# Altium schematic sheet BC28安全模组.SchDoc: 民用NB-IoT物联网通用膜式燃气表主控板原理图1
size A3; Date: 2022/4/25; DocumentNumber: WX0.008.316; Revision: V1; SheetNumber: 1; SheetTotal: 2
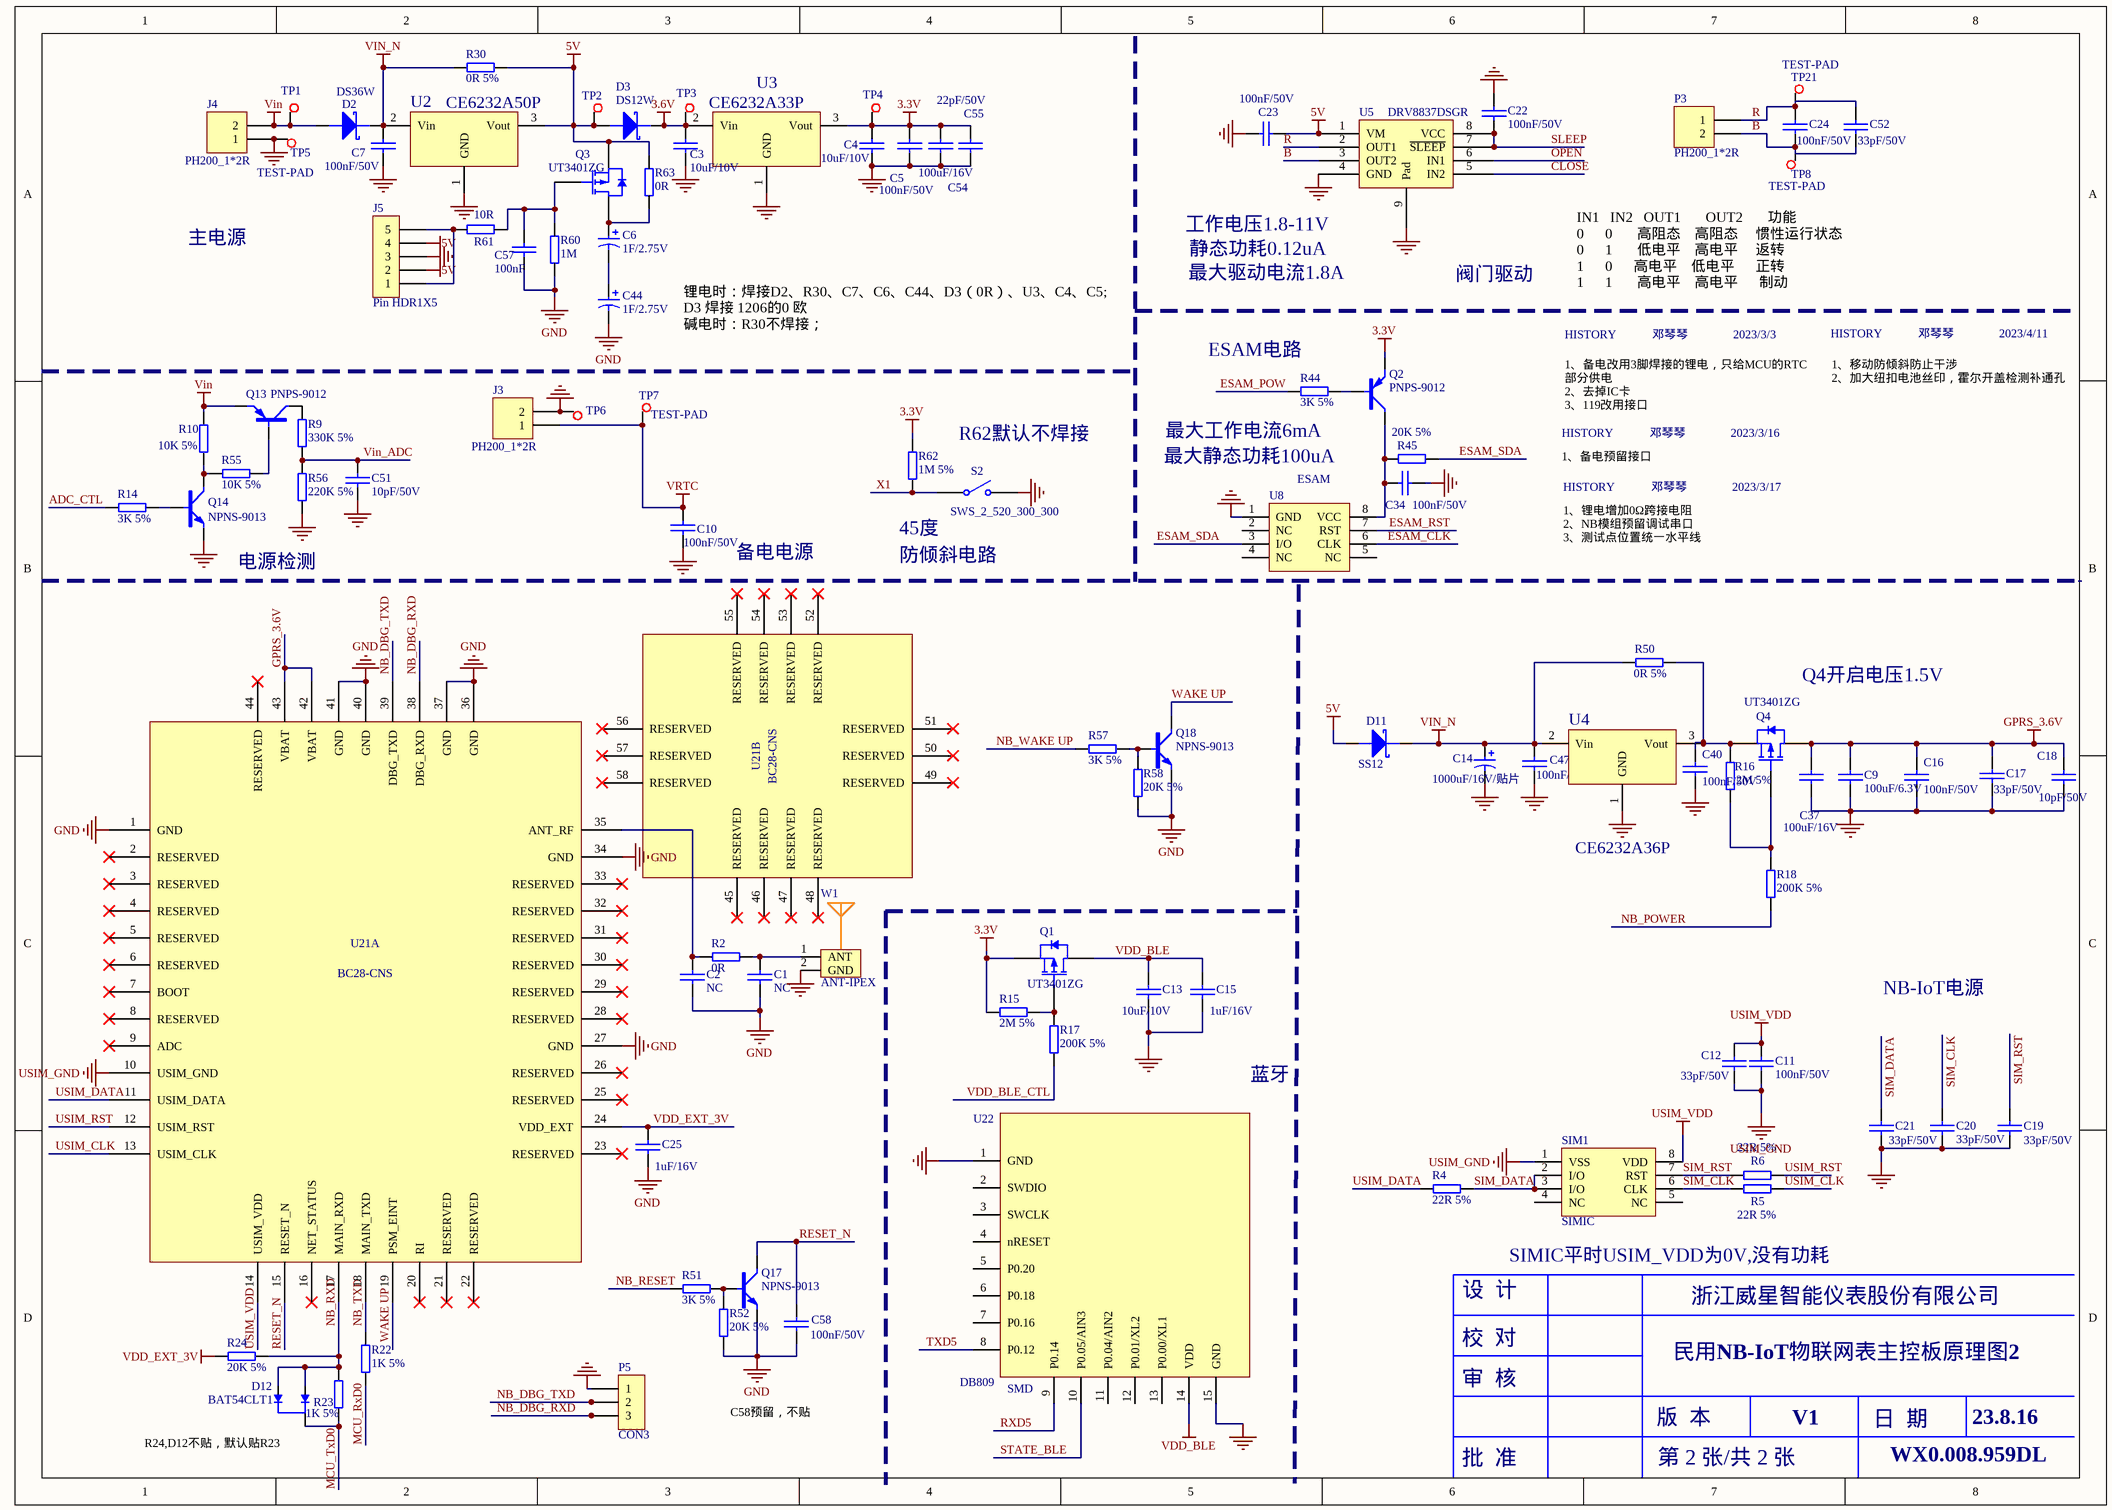
[diagram p0: BC28安全模组.SchDoc]

## Parts
C1  NC  [CAP0603]
C2  NC  [CAP0603]
C3  10uF/10V  [CAP0603]
C4  10uF/10V  [CAP0603]
C5  100nF/50V  [CAP0603]
C6  1F/2.75V  [CAPPC_350_800_1600R]
C7  100nF/50V  [CAP0603]
C9  100uF/6.3V  [GRM1206]
C10  100nF/50V  [CAP0603]
C11  100nF/50V  [CAP0603]
C12  33pF/50V  [CAP0603]
C13  10uF/10V  [CAP0603]
C14  1000uF/16V/贴片  [CAP-SMD_BD10.0-L10.3-W10.3-FD]
C15  1uF/16V  [CAP0603]
C16  100nF/50V  [CAP0603]
C17  33pF/50V  [CAP0603]
C18  10pF/50V  [CAP0603]
C19  33pF/50V  [CAP0603]
C20  33pF/50V  [CAP0603]
C21  33pF/50V  [CAP0603]
C22  100nF/50V  [CAP0603]
C23  100nF/50V  [CAP0603]
C24  100nF/50V  [CAP0603]
C25  1uF/16V  [CAP0603]
C34  100nF/50V  [CAP0603]
C37  100uF/16V  [GRM31CR60J107ME39L]
C40  100nF/50V  [CAP0603]
C44  1F/2.75V  [CAPPC_350_800_1600R]
C47  100nF/50V  [CAP0603]
C51  10pF/50V  [CAP0603]
C52  33pF/50V  [CAP0603]
C54  100uF/16V  [GRM31CR60J107ME39L]
C55  22pF/50V  [CAP0603]
C57  100nF  [CAP0603]
C58  100nF/50V  [CAP0603]
D2  DS36W  [SOD-123FL]
D3  DS12W  [SOD-123FL]
D11  SS12  [DO-214AC]
D12  BAT54CLT1  [SOT-23]
J3  PH200_1*2R  [BAT-DIP-2]
J4  PH200_1*2R  [PH200_1*2R_BAT]
J5  Pin HDR1X5  [Pin HDR1X5/2.54mm-S]
P3  PH200_1*2R  [PH200_1*2R]
P5  CON3  [SIP-3]
Q1  UT3401ZG  [SOT-23]
Q2  PNPS-9012  [SOT-23]
Q3  UT3401ZG  [SOT-23]
Q4  UT3401ZG  [SOT-23]
Q13  PNPS-9012  [SOT-23]
Q14  NPNS-9013  [SOT-23]
Q17  NPNS-9013  [SOT-23]
Q18  NPNS-9013  [SOT-23]
R2  0R  [RES0603]
R4  22R 5%  [RES0603]
R5  22R 5%  [RES0603]
R6  22R 5%  [RES0603]
R9  330K 5%  [RES0603]
R10  10K 5%  [RES0603]
R14  3K 5%  [RES0603]
R15  2M 5%  [RES0603]
R16  2M 5%  [RES0603]
R17  200K 5%  [RES0603]
R18  200K 5%  [RES0603]
R22  1K 5%  [RES0603]
R23  1K 5%  [RES0603]
R24  20K 5%  [RES0603]
R30  0R 5%  [RES1206]
R44  3K 5%  [RES0603]
R45  20K 5%  [RES0603]
R50  0R 5%  [RES1206]
R51  3K 5%  [RES0603]
R52  20K 5%  [RES0603]
R55  10K 5%  [RES0603]
R56  220K 5%  [RES0603]
R57  3K 5%  [RES0603]
R58  20K 5%  [RES0603]
R60  1M  [RES0603]
R61  10R  [RES0603]
R62  1M 5%  [RES0603]
R63  0R  [RES1206]
S2  SWS_2_520_300_300  [SWS_2_520_300]
SIM1  SIMIC  [SIMIC]
TP1  TEST-PAD  [TEST-PAD]  (value not drawn)
TP2  TEST-PAD  [TEST-PAD]  (value not drawn)
TP3  TEST-PAD  [TEST-PAD]  (value not drawn)
TP4  TEST-PAD  [TEST-PAD]  (value not drawn)
TP5  TEST-PAD  [TEST-PAD]
TP6  TEST-PAD  [TEST-PAD]  (value not drawn)
TP7  TEST-PAD  [TEST-PAD]
TP8  TEST-PAD  [TEST-PAD]
TP21  TEST-PAD  [TEST-PAD]
U2  CE6232A50P  [SOT-89]
U3  CE6232A33P  [SOT-89]
U4  CE6232A36P  [SOT-89]
U5  DRV8837DSGR  [S-PWSON-N8]
U8  ESAM  [SOP-8]
U21  BC28-CNS  (parts A,B of 2)
U22  DB809  SMD/DIP: SMD  [DB809]
W1  ANT-IPEX  [ANT-IPEX]

## Nets
3.3V: C4.1 C5.1 C54.1 C55.1 Q1.2(S) Q2.2(E) R15.1 R62.2 TP4.1 U3.3(Vout)
3.6V: C3.1 D3.2 TP3.1 U3.2(Vin)
5V: C23.2 D3.1 D11.1 J5.2 J5.4 Q3.2(S) R30.2 R63.1 TP2.1 U2.3(Vout) U5.1(VM)
GND: C1.1 C2.1 C3.2 C4.2 C5.2 C7.2 C9.2 C10.2 C13.2 C14.2 C15.2 C16.2 C17.2 C18.2 C19.2 C20.2 C21.2 C22.1 C23.1 C25.2 C34.2 C37.2 C40.2 C44.2 C47.2 C51.1 C54.2 C55.2 C57.2 C58.2 J3.2 J4.1 J5.3 P5.1 Q14.2(E) Q17.2(E) Q18.2(E) R52.1 R56.2 R58.1 R60.2 S2.2 TP5.1 TP6.1 U2.1(GND) U3.1(GND) U4.1(GND) U5.4(GND) U5.9(Pad) U8.1(GND) U21.1(GND) U21.27(GND) U21.34(GND) U21.36(GND) U21.37(GND) U21.40(GND) U21.41(GND) U22.1(GND) U22.15(GND) W1.2(GND)
GPRS_3.6V: C9.1 C16.1 C17.1 C18.1 C37.1 Q4.3(D) U21.42(VBAT) U21.43(VBAT)
USIM_GND: C11.2 C12.2 SIM1.1(VSS) U21.10(USIM_GND)
USIM_VDD: C11.1 C12.1 SIM1.8(VDD) U21.14(USIM_VDD)
VDD_BLE: C13.1 C15.1 Q1.3(D) U22.14(VDD)
VDD_EXT_3V: C25.1 R24.1 U21.24(VDD_EXT)
Vin: D2.1 J4.2 Q13.2(E) R10.2 TP1.1
VIN_N: C7.1 C14.1 C47.1 D2.2 D11.2 R30.1 R50.1 U2.2(Vin) U4.2(Vin)
VRTC: C10.1 J3.1 TP7.1
ADC_CTL: R14.1
B: C24.2 C52.2 P3.2 TP8.1 U5.3(OUT2)
CLOSE: U5.5(IN2)
ESAM_CLK: U8.6(CLK)
ESAM_POW: R44.1
ESAM_RST: U8.7(RST)
ESAM_SDA: R45.2 U8.3(I/O)
MCU_RxD0: R22.1
MCU_TxD0: D12.3(C) R23.2
NB_DBG_RXD: P5.3 U21.38(DBG_RXD)
NB_DBG_TXD: P5.2 U21.39(DBG_TXD)
NB_POWER: R18.1
NB_RESET: R51.1
NB_RXD: D12.1(A) D12.2(A) R23.1 R24.2 U21.17(MAIN_RXD)
NB_TXD: R22.2 U21.18(MAIN_TXD)
NB_WAKE UP: R57.1
OPEN: U5.6(IN1)
R: C24.1 C52.1 P3.1 TP21.1 U5.2(OUT1)
RESET_N: C58.1 Q17.3(C) U21.15(RESET_N)
RXD5: U22.9(P0.14)
SIM_CLK: C20.1 R5.1 SIM1.6(CLK)
SIM_DATA: C21.1 R4.2 SIM1.2(I/O) SIM1.3(I/O)
SIM_RST: C19.1 R6.1 SIM1.7(RST)
SLEEP: C22.2 U5.7(~{SLEEP}) U5.8(VCC)
STATE_BLE: U22.10(P0.05/AIN3)
TXD5: U22.8(P0.12)
USIM_CLK: R5.2 U21.13(USIM_CLK)
USIM_DATA: R4.1 U21.11(USIM_DATA)
USIM_RST: R6.2 U21.12(USIM_RST)
VDD_BLE_CTL: R17.1
Vin_ADC: C51.2 R9.2 R56.1
WAKE UP: Q18.3(C) U21.19(PSM_EINT)
X1: R62.1 S2.1
NetC1_2: C1.2 R2.1 W1.1(ANT)
NetC2_2: C2.2 R2.2 U21.35(ANT_RF)
NetC6_1: C6.1 Q3.3(D) R63.2
NetC6_2: C6.2 C44.1
NetC34_1: C34.1 Q2.3(C) R45.1 U8.8(VCC)
NetC40_1: C40.1 Q4.2(S) R16.2 R50.2 U4.3(Vout)
NetC57_1: C57.1 Q3.1(G) R60.1 R61.1
NetJ5_1: J5.1 J5.5 R61.2
NetQ1_1: Q1.1(G) R15.2 R17.2
NetQ2_1: Q2.1(B) R44.2
NetQ4_1: Q4.1(G) R16.1 R18.2
NetQ13_1: Q13.1(B) R55.2
NetQ13_3: Q13.3(C) R9.1
NetQ14_1: Q14.1(B) R14.2
NetQ14_3: Q14.3(C) R10.1 R55.1
NetQ17_1: Q17.1(B) R51.2 R52.2
NetQ18_1: Q18.1(B) R57.2 R58.2

Not connected (* = marked no-connect by the designer): SIM1 4(NC) 5(NC); U8 2(NC) 4(NC) 5(NC); U21 2(RESERVED)* 3(RESERVED)* 4(RESERVED)* 5(RESERVED)* 6(RESERVED)* 7(BOOT)* 8(RESERVED)* 9(ADC)* 16(NET_STATUS)* 20(RI)* 21(RESERVED)* 22(RESERVED)* 23(RESERVED)* 25(RESERVED)* 26(RESERVED)* 28(RESERVED)* 29(RESERVED)* 30(RESERVED)* 31(RESERVED)* 32(RESERVED)* 33(RESERVED)* 44(RESERVED)* 45(RESERVED)* 46(RESERVED)* 47(RESERVED)* 48(RESERVED)* 49(RESERVED)* 50(RESERVED)* 51(RESERVED)* 52(RESERVED)* 53(RESERVED)* 54(RESERVED)* 55(RESERVED)* 56(RESERVED)* 57(RESERVED)* 58(RESERVED)*; U22 2(SWDIO) 3(SWCLK) 4(nRESET) 5(P0.20) 6(P0.18) 7(P0.16) 11(P0.04/AIN2) 12(P0.01/XL2) 13(P0.00/XL1)

## Notes on the sheet
- 主电源
- 工作电压1.8-11V
- 最大驱动电流1.8A
- 静态功耗0.12uA
- 阀门驱动
- IN1   IN2   OUT1       OUT2       功能
  0      0       高阻态    高阻态     惯性运行状态
  0      1       低电平    高电平     返转
  1      0      高电平    低电平      正转
  1      1       高电平    高电平      制动
- 锂电时：焊接D2、R30、C7、C6、C44、D3（0R）、U3、C4、C5; D3 焊接 1206的0 欧
  碱电时：R30不焊接；
- (near R44) ESAM电路
- HISTORY
- 邓琴琴
- 2023/3/3
- 2023/4/11
- R62默认不焊接
- 最大工作电流6mA
- 1、备电改用3脚焊接的锂电，只给MCU的RTC部分供电
  2、去掉IC卡
  3、119改用接口
- 2023/3/16
- 1、移动防倾斜防止干涉
  2、加大纽扣电池丝印，霍尔开盖检测补通孔
- 最大静态功耗100uA
- 1、备电预留接口
- 2023/3/17
- 电源检测
- 备电电源
- 防倾斜电路
- 45度
- 1、锂电增加0Ω跨接电阻
  2、NB模组预留调试串口
  3、测试点位置统一水平线
- Q4开启电压1.5V
- NB-IoT电源
- 蓝牙
- SIMIC平时USIM_VDD为0V,没有功耗
- 设  计
- 浙江威星智能仪表股份有限公司
- 审  核
- 校  对
- 民用NB-IoT物联网表主控板原理图2
- R24,D12不贴，默认贴R23
- C58预留，不贴
- 版  本
- V1
- 日  期
- WX0.008.959DL
- 23.8.16
- 批  准
- 第 2 张/共 2 张
- 设   计
- 校   对
- 冯翰
- 审   核
- 标准化
- 版本
- 日期
- 批   准
- 刘晓峰
- 第       张  /  共       张

## Library data of the parts
C1 C2 = 101020103-0005: 12P,50 V,±5%,0603,国巨,CC0603JRNPO9BN12; Part Name: 0603贴片电容; ID: 11; SMD/DIP: SMD; Part Number: 101020103-0005
C3 C4 C13 = 101020103-0026: 106pF,10 V,±10%,0603,村田,GRM188R61A106KE47D; Part Name: 0603贴片电容; ID: 8; SMD/DIP: SMD; Part Number: 101020103-0026
C5 C7 C10 C11 C16 C22-C24 C34 C40 C47 C52 C58 = 101020103-0021: 104pF,50 V,±10%,0603,国巨,CC0603KRX7R9BB104; Part Name: 0603贴片电容; ID: 3; SMD/DIP: SMD; Part Number: 101020103-0021
C6 C44 = 1010202-0015: 1F,2.75 V,-20%~+20%,8mm*16mm,红宝石,2.7 DMC 1 M MY4 8X16; Part Name: 法拉电容; ID: 12; SMD/DIP: DIP; Part Number: 1010202-0015
C9 = 101020101-0020: 100uF,6.3 V,±20%,1206,村田,GRM31CR60J107ME39L; Part Name: 贴片电容; ID: 27; SMD/DIP: SMD; Part Number: 101020101-0020
C12 C17 C19-C21 = 101020103-0027: 33pF,50 V,±10%,0603,国巨,CC0603KRNPO9BN33; Part Name: 0603贴片电容; ID: 18; SMD/DIP: SMD; Part Number: 101020103-0027
C14 = 1010203-0029: 1000UF,16V,±20%,贴片10*10.2MM,深圳市三炎科电子科技有限公司,16V1000UF; Part Number: 1010203-0026; Part Name: 电解电容; ID: 2; SMD/DIP: DIP
C15 C25 = 101020103-0003: 105pF,16 V,±10%,0603,国巨,CC0603KRX7R7BB105; Part Name: 0603贴片电容; ID: 14; SMD/DIP: SMD; Part Number: 101020103-0003
C18 C51 = 101020103-0014: 10pF,50 V,±5%,0603,X7R,国巨,CC0603JRNPO9BN100; Part Name: 0603贴片电容; ID: 7; SMD/DIP: SMD; Part Number: 101020103-0014
C37 = 101020101-0005: Part Name: 1206贴片电容; ID: 9; SMD/DIP: SMD
C54 = 101020101-0005: 100u,16 V,±10%,1206,国巨,CC1206KRNPO7BN106P; Part Name: 1206贴片电容; ID: 9; SMD/DIP: SMD
C55 = 101020103-0009: 22pF,50 V,±5%,0603,国巨,CC0603JRNPO9BN22; Part Name: 0603贴片电容; ID: 16; SMD/DIP: SMD; Part Number: 101020103-0009
C57 = CAP: 无极性电容
D2 = 101040101-0048: DS36W,SOD123-FL,3 A,42 V,60 V,浙江领晨科技有限公司,DS36W; Part Number: 101040101-0055; Part Name: 贴片肖特基; ID: 8; SMD/DIP: SMD
D3 = 101040101-0048: DS12W,SOD-123FL,1 A,0.55 V,20 V,领晨科技,DS12W; Part Name: 贴片肖特基; ID: 9; SMD/DIP: SMD; Part Number: 101040101-0048
D11 = 101040101-0009: SS12,DO-214AC,1 A,0.55 V,20 V,昶鑫,SS12; Part Name: 贴片肖特基; ID: 13; SMD/DIP: SMD; Part Number: 101040101-0009
D12 = 101040101-0038: BAT54CLT1，SOT23-3,SOT23-3,0.2 A,0.8 V,30 V,安森美,BAT54CLT1; Part Name: 贴片肖特基; ID: 8; SMD/DIP: SMD; Part Number: 101040101-0038
J3 J4 P3 = 1010902-0105: 2.0-2AW,直插弯座，2PIN，脚间距2mm，带防翘起,公头,单排,2.0-2AW;直插弯座，2PIN,脚间距2mm，带防翘起; Part Name: PH座; ID: 11; SMD/DIP: DIP; Part Number: 1010902-0105
P5 = CON3: Connector
Q1 Q3 Q4 = 101040201-0013: UT3401ZG,P-MOS,SOT-23,UTC,UT3401ZG; Part Name: 功率MOS管; ID: 18; SMD/DIP: SMD; Part Number: 101040201-0013
Q2 = 101040201-0001: 9012,PNP,SOT-23,JCET;长电,S9012; Part Name: 贴片三极管; ID: 16; SMD/DIP: SMD; Part Number: 101040201-0001
Q13 = 101040201-0001: 9012,PNP,SOT-23,JCET;长电,S9012; Part Name: 贴片三极管; ID: 17; SMD/DIP: SMD; Part Number: 101040201-0001
Q14 Q17 Q18 = 101040201-0002: 9013,NPN,SOT-23,长电,S9013; Part Name: 贴片三极管; ID: 15; SMD/DIP: SMD; Part Number: 101040201-0002
R2 = 101010103-0001: Part Name: 0603贴片电阻; ID: 1; SMD/DIP: SMD; Part Number: 101010103-0001
R4-R6 = 101010103-0009: 国巨,±5%,0603,,155 ℃,-55 ℃,RC0603JR-0722RL,无铅,200 ppm/℃,1/10W,,22欧; Part Name: 0603贴片电阻; ID: 17; SMD/DIP: SMD; Part Number: 101010103-0009
R9 = 101010103-0066: 330K,±5%,1/10W,0603,国巨,RC0603JR-07330KL; Part Name: 0603贴片电阻; ID: 31; SMD/DIP: SMD; Part Number: 101010103-0066
R10 R44 R55 = 101010103-0003: 国巨,±5%,0603,,155 ℃,-55 ℃,RC0603JR-0710KL,无铅,200 ppm/℃,1/10W,,10K; Part Name: 0603贴片电阻; ID: 7; SMD/DIP: SMD; Part Number: 101010103-0003
R14 = 101010103-0006: 国巨,±5%,0603,,155 ℃,-55 ℃,RC0603JR-073KL,无铅,100 ppm/℃,1/10W,,3K; Part Name: 0603贴片电阻; ID: 23; SMD/DIP: SMD; Part Number: 101010103-0006
R15 R17 = 101010103-0003: 10K±5%,1/10W,0603; Part Name: 0603贴片电阻; ID: 32; Part Number: 101010103-0003
R16 = 101010103-0025: 国巨,±5%,0603,,155 ℃,-55 ℃,RC0603JR-072ML,含铅,100 ppm/℃,1/10W,,2M; Part Name: 0603贴片电阻; ID: 20; SMD/DIP: SMD; Part Number: 101010103-0025
R18 = 101010103-0034: 200K,±5%,1/10W,0603,国巨,RC0603JR-07200KL; Part Name: 0603贴片电阻; ID: 13; SMD/DIP: SMD; Part Number: 101010103-0034
R22 R23 R51 R52 R56-R58 = 101010103-0044: 220K,±5%,1/10W,0603,国巨,RC0603JR-07220KL; Part Name: 0603贴片电阻; ID: 30; SMD/DIP: SMD; Part Number: 101010103-0044
R24 R45 = 101010103-0004: 国巨,±5%,0603,,155 ℃,-55 ℃,RC0603JR-0720KL,无铅,200 ppm/℃,1/10W,,20K; Part Name: 0603贴片电阻; ID: 15; SMD/DIP: SMD; Part Number: 101010103-0004
R30 R50 = 101010101-0013: 0Ω,±5%,1/4W,1206,国巨,RC1206JR-070RL; Part Name: 1206贴片电阻; ID: 2; SMD/DIP: SMD; Part Number: 101010101-0013
R60 R61 R63 = RES
R62 = 101010103-0002: 国巨,±5%,0603,,155 ℃,-55 ℃,RC0603JR-071ML,无铅,200 ppm/℃,1/10W,,1M; Part Name: 0603贴片电阻; ID: 11; SMD/DIP: SMD; Part Number: 101010103-0002
S2 = 1011001-0041: CSX-SEN-645B,垂直45°开关转换,3*5.2mm,360°任意方位倾斜检测,深圳市成晟科技有限公司; Part Number: 1011001-0051; Part Name: 倾斜开关; ID: 33; SMD/DIP: SMD
SIM1 = AD_XN_SIMIC_01: SIMIC虚拟器件; ID: 20; SMD/DIP: SMD; Part Number: AD_XN_SIMIC_01; Part Name: SIMIC
TP1-TP8 TP21 = AD_WXHJ_TEST-PAD_01: 单面焊盘测试点; Part Name: 测试点; ID: 23; SMD/DIP: SMD; Part Number: AD_WXHJ_TEST-PAD_01
U2 = 1010503-0013: S-1206B50-U3,S-1206B50-U3,SOT89-3,6.5 V,1.7 V,0.2 V,5 V,250mA@VIN≧VOUT(S)＋1.0 V﹐1.5 V≦VOUT(S),1 uA,精工电子; Part Name: 贴片稳压器; ID: 6; SMD/DIP: SMD; Part Number: 1010503-0013
U3 = 1010503-0002: S-1206B33-U3T1G,S-1206B33-U3T1G,SOT89-3,6.5 V,1.7 V,0.15 V,3.3 V,250mA@VIN≧VOUT(S)＋1.0 V﹐1.5 V≦VOUT(S),1 uA,精工电子; Part Name: 线性稳压芯片; ID: 5; SMD/DIP: SMD; Part Number: 1010503-0002
U4 = 1010503-0031: CE6232A36P,CE6232A36P,SOT89-3,8 V,1.8 V,0.11 V,3.6 V,600mA,0.8 uA,南京芯力微电子有限公司; Part Name: 贴片稳压器; ID: 30; SMD/DIP: SMD; Part Number: 1010503-0031
U5 = 101050101-0060: DRV8837DSGR,S-PWSON-N8,TI,DRV8837DSGR; Part Name: 驱动芯片; ID: 23; SMD/DIP: SMD; Part Number: 101050101-0060
U8 = AD_XN_ESAM_01: ESAM虚拟器件; Part Name: ESAM芯片; ID: 11; SMD/DIP: SMD; Part Number: AD_XN_ESAM_01
U21 = BC28-CNS: BC28-CNS Moudle 58Pin 15.8X17.7mm H2.2mm RO; Manufacturer: Quectel; Geometry.Height: 2.2mm; Part Description: BC28-CNS Moudle 58Pin 15.8X17.7mm H2.2mm RO; Value: BC28-CNS
U22 = 1011402-0194: 北高智蓝牙模块DB809; Part Name: 蓝牙模块; ID: 15; Part Number: 1011402-0194
W1 = 1010902-0053: IPEX，配GPRS天线转接线; Part Name: IPEX座; ID: 2; SMD/DIP: DIP; Part Number: 1010902-0053